# EAGLE design 629-test_v1.0 (EAGLE 6.5.0)
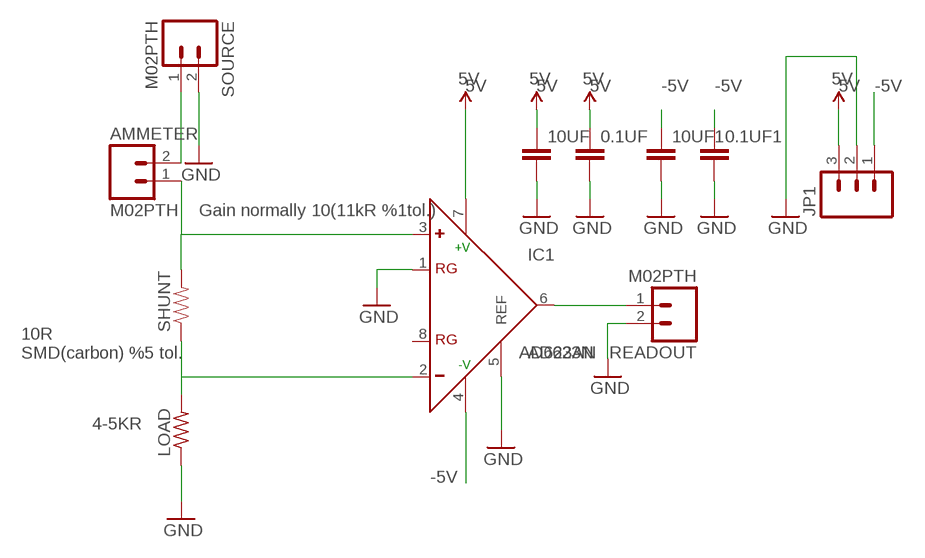
[diagram p0: schematic, sheet 1]

## Parts
0.1UF  CAPPTH1  [CAP-PTH-5MM]
0.1UF1  CAPPTH1  [CAP-PTH-5MM]
10UF  CAPPTH1  [CAP-PTH-5MM]
10UF1  CAPPTH1  [CAP-PTH-5MM]
AMMETER  M02PTH  [1X02]
IC1  AD623N  [DIL08]
JP1  M03LOCK  [1X03_LOCK]
LOAD  R-US_0207/10  [0207/10]
READOUT  M02PTH  [1X02]
SHUNT  RESISTOR1206  [1206]
SOURCE  M02PTH  [1X02]

## Nets
5V: 0.1UF.1 10UF.1 IC1.7(+V) JP1.3
-5V: 0.1UF1.1 10UF1.1 IC1.4(-V) JP1.1
GND: 0.1UF1.2 0.1UF.2 10UF1.2 10UF.2 IC1.1(RG) IC1.5(REF) JP1.2 LOAD.1 READOUT.2 SOURCE.2
N$3: AMMETER.1 IC1.3(+) SHUNT.2
N$4: IC1.2(-) LOAD.2 SHUNT.1
N$5: AMMETER.2 SOURCE.1
N$6: IC1.6(OUT) READOUT.1
Unconnected: IC1.8(RG)

## Notes on the sheet
- 5V | 5V | 5V | 5V
- Gain normally 10(11kR %1tol.)
- 10R
  SMD(carbon) %5 tol.
- AD623AN
- 4-5KR

## Library data of the parts
0.1UF 0.1UF1 10UF 10UF1 = SparkFun-Capacitors:CAP: Capacitor Standard 0603 ceramic capacitor, and 0.1" leaded capacitor.
AMMETER READOUT SOURCE = SparkFun-Connectors:M02: Standard 2-pin 0.1" header. Use with - straight break away headers ( PRT-00116) - right angle break away headers (PRT-00553) - swiss pins (PRT-00743) - machine pins (PRT-00117) - female headers (PRT-00115) Molex polarized connector foot print use with: PRT-08233 with associated crimp pins and housings. 2.54_SCREWTERM for use with PRT-10571. 3.5mm Screw Terminal footprints for PRT-08084 5mm Screw Terminal footprints for use with PRT-08432
IC1 = analog-devices:AD623: Single-Supply, Rail-to-Rail, Low Cost Instrumentation Amplifier Source: http://www.analog.com/static/imported-files/data_sheets/AD623.pdf; MF: ALTERA CORPORATION; MPN: AD623ANZ; OC_FARNELL: 9603700; OC_NEWARK: 59K4402
JP1 = SparkFun-Connectors:M03: Header 3 Standard 3-pin 0.1" header. Use with straight break away headers (SKU : PRT-00116), right angle break away headers (PRT-00553), swiss pins (PRT-00743), machine pins (PRT-00117), and female headers (PRT-00115). Molex polarized connector foot print use with SKU : PRT-08232 with associated crimp pins and housings.
LOAD = adafruit:R-US_: RESISTOR, American symbol
SHUNT = SparkFun-Resistors:RESISTOR: Resistor Basic schematic elements and footprints for 0603, 1206, and PTH resistors.

## Board
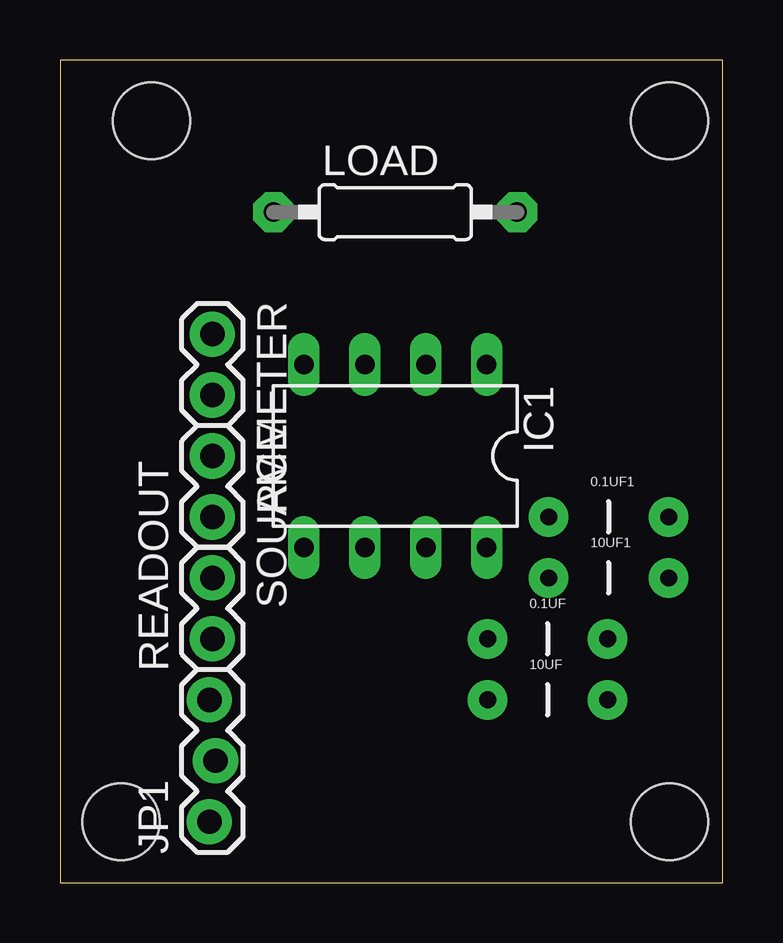
[diagram p1: board, top side]
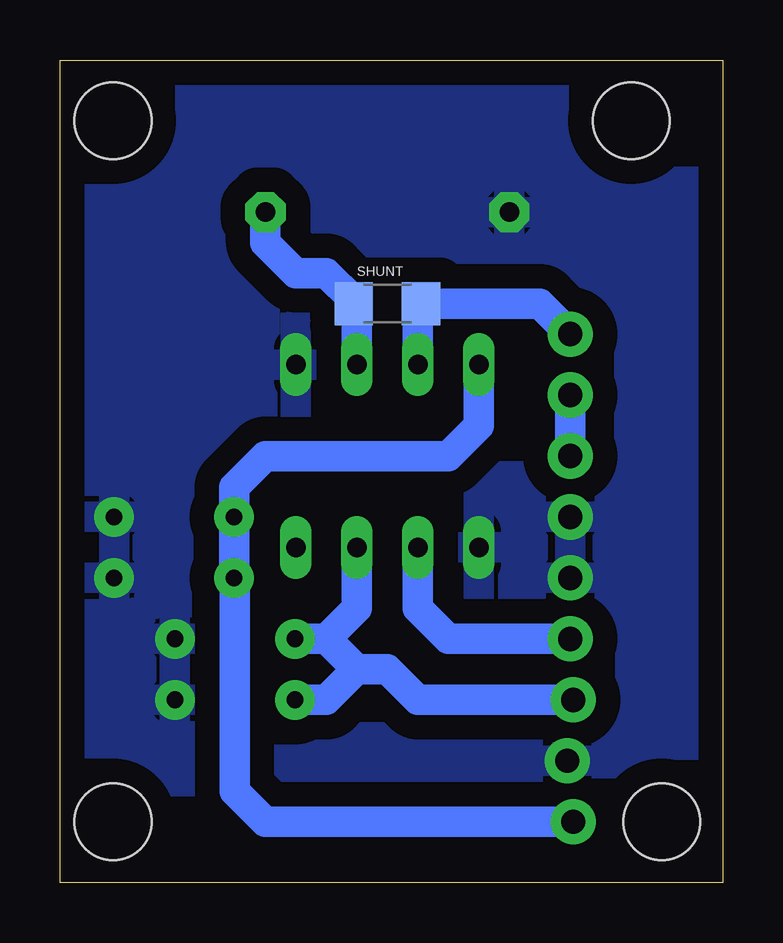
[diagram p2: board, bottom side, seen from below]

Size 27.61 x 34.28 mm. Coordinates in mm from the lower left corner, seen from the top.
Outline: 0,0 27.61,0 27.61,34.28 0,34.28 0,0
Copper layers (1*16): Top 0.035mm / dielectric 1.5mm / Bottom 0.035mm
Design rules "default": minimum track width 10mil, minimum drill 24mil, track to track 8mil, track to pad 8mil, pad to pad 8mil, via to via 8mil, smd to smd 8mil, copper to edge 40mil, drill to drill 8mil, minimum pad ring 10mil, minimum via ring 8mil, stop-mask expansion 4mil, vias tented up to drill 0mil, thermal gap 10mil
Holes 3.2 mm at 3.81,31.75 25.4,31.75 25.4,2.54 2.54,2.54

### Footprints (pad centres in the part's own frame; a part is rotated, then mirrored left to right if it is on the bottom)
CAP-PTH-5MM = drill 0.7 pad 1.651: 1 -2.5,0; 2 2.5,0
1X02 = drill 1.016 pad 1.88: 1 0,0; 2 2.54,0
DIL08 = drill 0.813 long: 1 -3.81,-3.81; 2 -1.27,-3.81; 3 1.27,-3.81; 4 3.81,-3.81; 5 3.81,3.81; 6 1.27,3.81; 7 -1.27,3.81; 8 -3.81,3.81
1X03_LOCK = drill 1.016 pad 1.88: 1 0,0.127; 2 2.54,-0.127; 3 5.08,0.127
0207/10 = drill 0.813 pad 1.676 octagon: 1 -5.08,0; 2 5.08,0
1206 = smd 1.6 x 1.8: 1 -1.4,0; 2 1.4,0

### Placement (x,y rotation side)
0.1UF  20.32,10.16 0 top
0.1UF1  22.86,15.24 0 top
10UF  20.32,7.62 0 top
10UF1  22.86,12.7 0 top
AMMETER  6.35,22.86 270 top
IC1  13.97,17.78 180 top
JP1  6.35,2.54 90 top
LOAD  13.97,27.94 0 top
READOUT  6.35,10.16 90 top
SHUNT  13.97,24.13 0 bottom
SOURCE  6.35,17.78 270 top

### Tracks (layer width: path | path; a pad name or v marks a point on that pad's centre or on a via)
5V
  Bottom 1.27: 0.1UF.1 16.51,10.16 | 15.24,8.89 16.51,7.62 10UF.1 | IC1.7 15.24,11.43 16.51,10.16 | 16.51,10.16 15.24,8.89 | 15.24,8.89 13.97,8.89 12.7,7.62 JP1.3
-5V
  Bottom 1.27: JP1.1 19.05,2.54 20.32,3.81 20.32,12.66 10UF1.1 0.1UF1.1 | IC1.4 10.16,19.05 11.43,17.78 19.05,17.78 20.36,16.47 0.1UF1.1 | 0.1UF1.1 20.32,15.24
GND
  pour Bottom (isolate 1.016): 0,34.29 0,0 27.94,0 27.94,34.29
N$3
  Bottom 1.27: IC1.3 12.7,24 SHUNT.2 7.62,24.13 AMMETER.1
N$4
  Bottom 1.27: IC1.2 15.24,24 SHUNT.1 15.37,24.26 16.51,25.4 17.78,25.4 19.05,26.67 LOAD.2
N$5
  Bottom 1.27: SOURCE.1 AMMETER.2
N$6
  Bottom 1.27: READOUT.1 11.43,10.16 12.7,11.43 IC1.6